# EAGLE design Adafruit Power Switch (EAGLE 6.3)
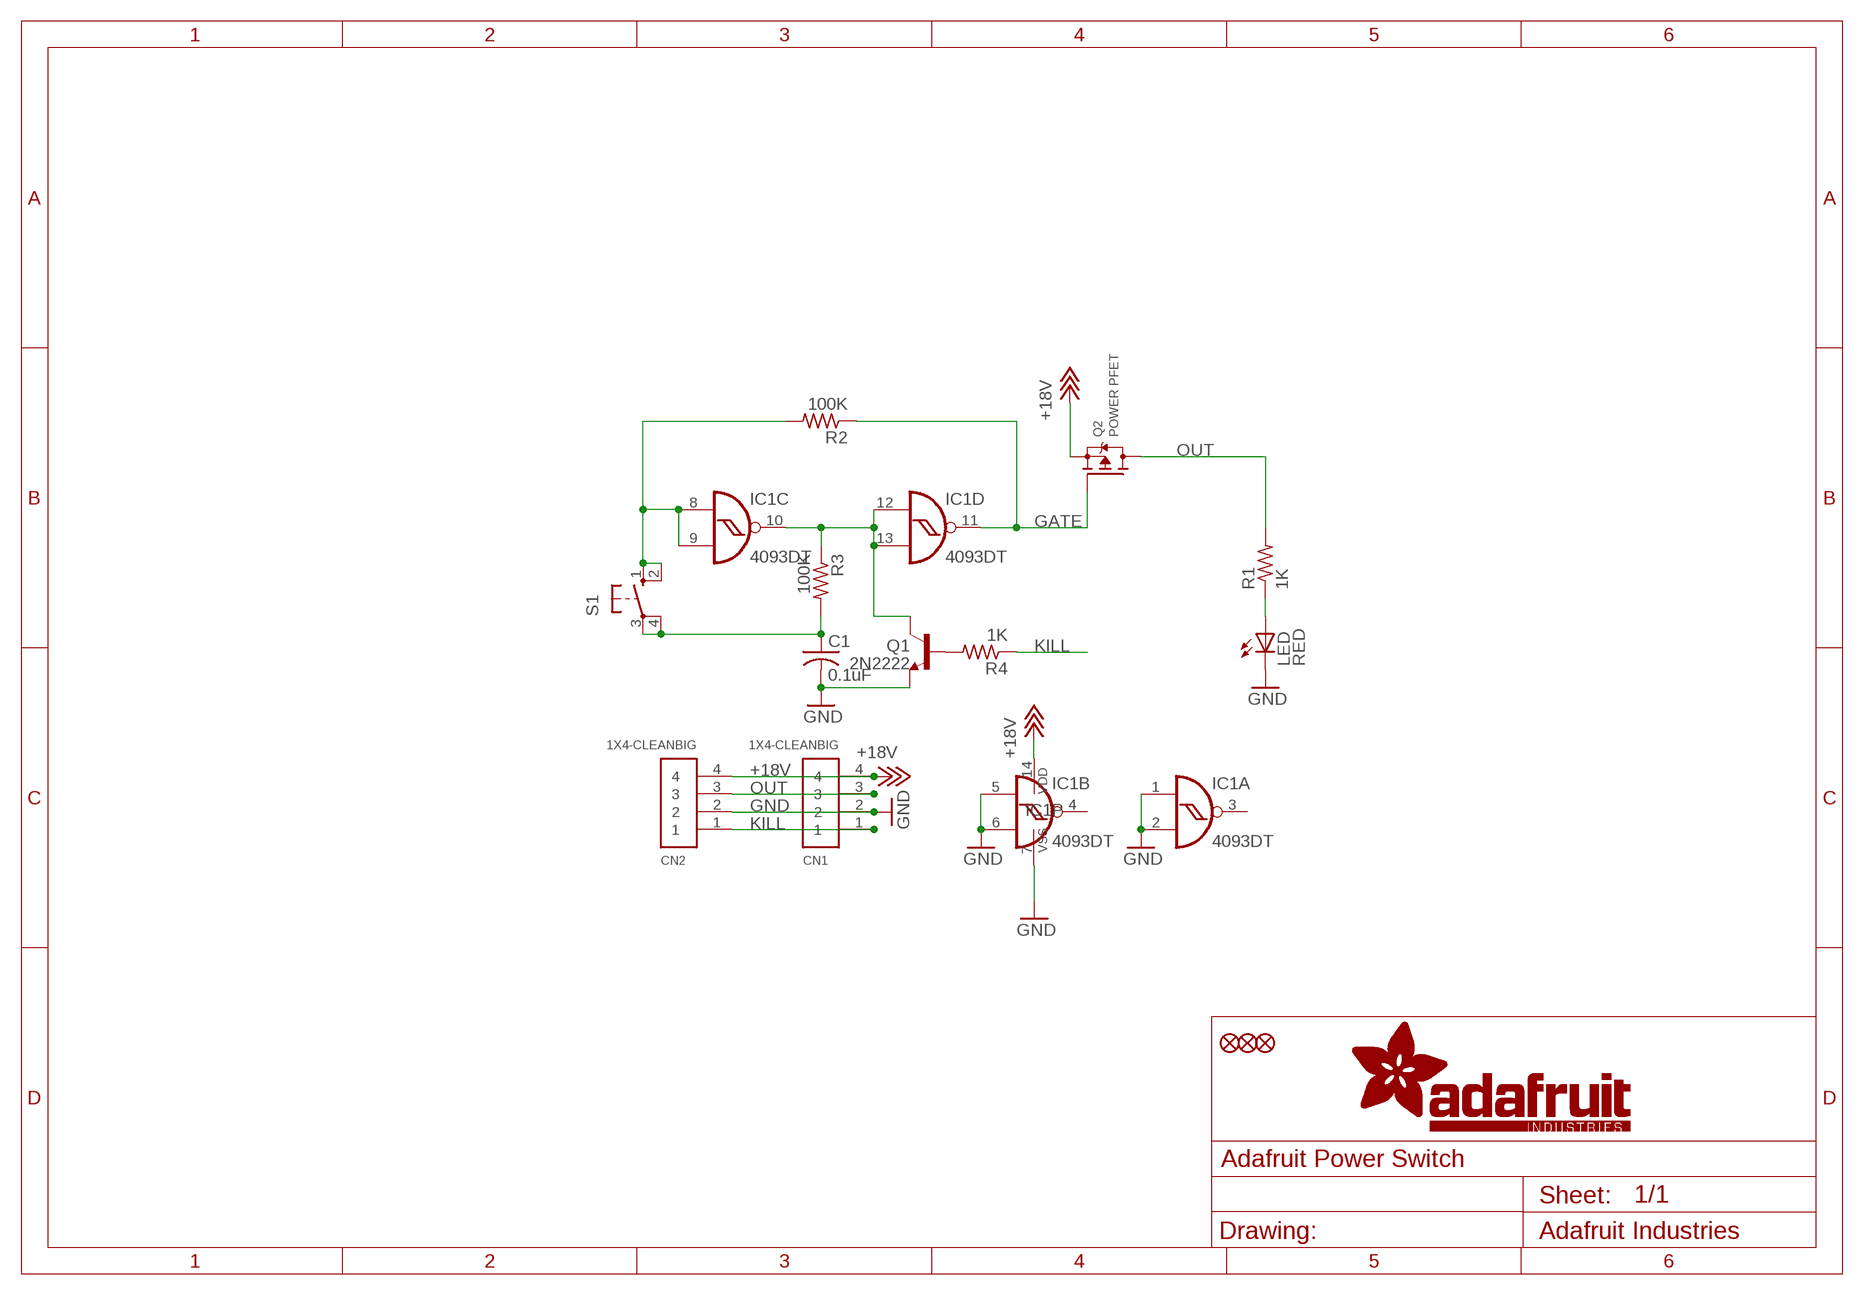
[diagram p0: schematic, sheet 1]

## Parts
C1  0.1uF  C-USC0805  [C0805]
CN1  1X4-CLEANBIG  [1X04-CLEANBIG]
CN2  1X4-CLEANBIG  [1X04-CLEANBIG]
FID1  FIDUCIAL""  [FIDUCIAL_1MM]
FID2  FIDUCIAL""  [FIDUCIAL_1MM]
FID3  FIDUCIAL""  [FIDUCIAL_1MM]
IC1  4093DT  [MC14093B-TSSOP14]
LED  RED  LEDCHIP-LED0805  [CHIP-LED0805]
Q1  2N2222  MMBT2222ALT1-NPN-SOT23-BEC  [SOT23-BEC]
Q2  POWER PFET  MOSFET-PWIDE  [SOT23-WIDE]
R1  1K  R-US_R0805  [R0805]
R2  100K  R-US_R0805  [R0805]
R3  100K  R-US_R0805  [R0805]
R4  1K  R-US_R0805  [R0805]
S1  40-XX-ROUND  [B3F-40XX-ROUND]

## Nets
+18V: CN1.4 CN2.4 IC1.14(P:VDD) Q2.2(S)
GATE: IC1.11(D:O) Q2.1(G) R2.1
GND: C1.2 CN1.2 CN2.2 IC1.1(A:I0) IC1.2(A:I1) IC1.5(B:I0) IC1.6(B:I1) IC1.7(P:VSS) LED.C Q1.E
KILL: CN1.1 CN2.1 R4.1
N$1: Q1.B R4.2
N$2: IC1.10(C:O) IC1.12(D:I0) IC1.13(D:I1) Q1.C R3.1
N$3: LED.A R1.1
N$5: C1.1 R3.2 S1.3(P) S1.4(P1)
N$7: IC1.8(C:I0) IC1.9(C:I1) R2.2 S1.1(S) S1.2(S1)
OUT: CN1.3 CN2.3 Q2.3(D) R1.2
Unconnected: IC1.3(A:O) IC1.4(B:O)

## Library data of the parts
C1 = adafruit:C-US: CAPACITOR, American symbol
CN1 CN2 = adafruit:1X4: 4-pin connector
FID1-FID3 = microbuilder:FIDUCIAL: Fiducial Alignment Points Various fiducial points for machine vision alignment.; BOM: EXCLUDE
IC1 = adafruit:4093: Quad 2-input NAND schmitt trigger
LED = adafruit:LED: LED OSRAM: - CHIPLED LG R971, LG N971, LY N971, LG Q971, LY Q971, LO R971, LY R971 LH N974, LH R974 LS Q976, LO Q976, LY Q976 LO Q996 - Hyper CHIPLED LW Q18S LB Q993, LB Q99A, LB R99A - SideLED LS A670, LO A670, LY A670, LG A670, LP A670 LB A673, LV A673, LT A673, LW A673 LH A674 LY A675 LS A676, LA A676, LO A676, LY A676, LW A676 LS A679, LY A679, LG A679 - Hyper Micro SIDELED® LS Y876, LA Y876, LO Y876, LY Y876 LT Y87S - SmartLED LW L88C, LW L88S LB L89C, LB L89S, LG L890 LS L89K, LO L89K, LY L89K LS L896, LA L896, LO L896, LY L896 - TOPLED LS T670, LO T670, LY T670, LG T670, LP T670 LSG T670, LSP T670, LSY T670, LOP T670, LYG T670 LG T671, LOG T671, LSG T671 LB T673, LV T673, LT T673, LW T673 LH T674 LS T676, LA T676, LO T676, LY T676, LB T676, LH T676, LSB T676, LW T676 LB T67C, LV T67C, LT T67C, LS T67K, LO T67K, LY T67K, LW E67C LS E67B, LA E67B, LO E67B, LY E67B, LB E67C, LV E67C, LT E67C LW T67C LS T679, LY T679, LG T679 LS T770, LO T770, LY T770, LG T770, LP T770 LB T773, LV T773, LT T773, LW T773 LH T774 LS E675, LA E675, LY E675, LS T675 LS T776, LA T776, LO T776, LY T776, LB T776 LHGB T686 LT T68C, LB T68C - Hyper Mini TOPLED® LB M676 - Mini TOPLED Santana® LG M470 LS M47K, LO M47K, LY M47K Source: http://www.osram.convergy.de/
Q1 = transistor:*-NPN-: NPN Transistror BF959 corrected 2008.03.06
Q2 = microbuilder:MOSFET-P: P-Channel Mosfet LEGEND VDS: Voltage Drain-Source ID: Drain Current RDS(ON): Drain-Source On-State Resistance VGS(TH): Gate-Source Threshold Voltage CISS: Drain-Source Input Capacitance SOT-23 Name VDS ID RDS(ON) VGS(TH) CISS Order Number IRLML5103 30V 760mA 600 mOhm -- 75pF @ 25V Digikey: IRLML5103PBFCT-ND IRLML6401 12V 4.3A 50 mOhm 950mV @ 250µA 830pF @ 10V Digikey: IRLML6401PBFTR-ND NTR0202PL 20V 400mA 800 mOhm 2.3V @ 250uA 70pF @ 5V Digikey: NTR0202PLT1GOSTR-ND NTR4101PT1G 20V 1.8A 85 mOhm 1.2V @ 250uA 675pF @ 10V Digikey: NTR4101PT1GOSCT-ND DMP2004K 20V 600mA 900 mOhm 1V @ 250uA 175pF @ 16V Digikey: DMP2004KDICT-ND PMV65XP 20V 3.9A 76 mOhm 950mV @ 1mA 725pF @ 20V Digikey: 568-2358-2-ND TO-252 Name VDS ID RDS(ON) VGS(TH) CISS Order Number AOD417 30V 25A 34 mOhm 3V @ 250µA 920pF @ 15V Digikey: 785-1106-2-ND
R1-R3 = rcl:R-US_: RESISTOR, American symbol
R4 = adafruit:R-US_: RESISTOR, American symbol
S1 = adafruit:40-XX: OMRON SWITCH

## Board
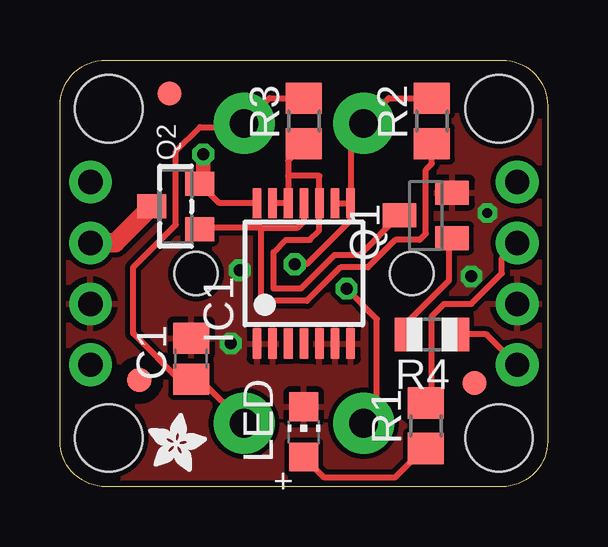
[diagram p1: board, top side]
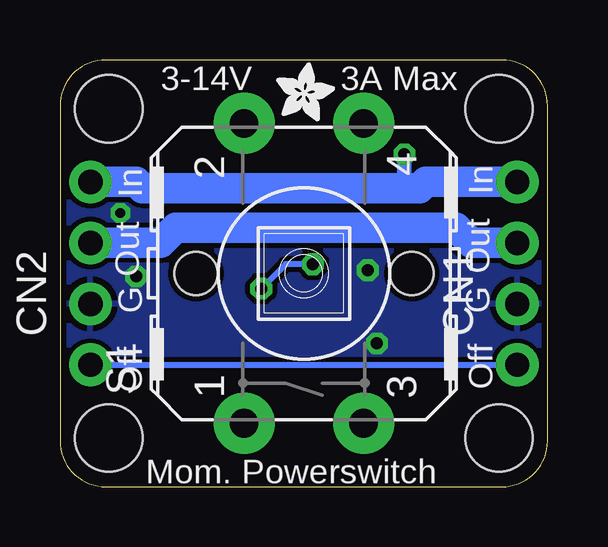
[diagram p2: board, bottom side, seen from below]

Size 20.32 x 17.78 mm. Coordinates in mm from the lower left corner, seen from the top.
Outline: 1.91,17.78 18.41,17.78 arc-90 20.32,15.88 20.32,1.91 arc-90 18.41,0 1.91,0 arc-90 0,1.91 0,15.88 arc-90 1.91,17.78
Copper layers (1*16): Top 0.035mm / dielectric 1.5mm / Bottom 0.035mm
Design rules "default": minimum track width 8mil, minimum drill 16mil, track to track 8mil, track to pad 8mil, pad to pad 8mil, via to via 8mil, smd to smd 8mil, copper to edge 10mil, drill to drill 8mil, minimum pad ring 10mil, minimum via ring 8mil, stop-mask expansion 4mil, vias tented up to drill 20mil, thermal gap 10mil
Holes 2.8 mm at 2.03,15.75 2.03,2.03 18.29,15.75 18.29,2.03

### Footprints (pad centres in the part's own frame; a part is rotated, then mirrored left to right if it is on the bottom)
C0805 = smd 1.3 x 1.5: 1 -0.85,0; 2 0.85,0
1X04-CLEANBIG = drill 1.016 pad 1.778: 1 -3.81,0; 2 -1.27,0; 3 1.27,0; 4 3.81,0
FIDUCIAL_1MM = smd 1 x 1: 1 0,0
MC14093B-TSSOP14 = smd 0.36 x 1.26: 1 -1.95,-2.925; 2 -1.3,-2.925; 3 -0.65,-2.925; 4 0,-2.925; 5 0.65,-2.925; 6 1.3,-2.925; 7 1.95,-2.925; 8 1.95,2.925; 9 1.3,2.925; 10 0.65,2.925; 11 0,2.925; 12 -0.65,2.925; 13 -1.3,2.925; 14 -1.95,2.925
CHIP-LED0805 = smd 1.2 x 1.2: A 0,-1.05; C 0,1.05
SOT23-BEC = smd 1 x 1.4: B -0.95,-1.1; C 0,1.1; E 0.95,-1.1
SOT23-WIDE = smd 1 x 1.2: 1 -0.95,-1; 2 0.95,-1; 3 0,1
R0805 = smd 1.3 x 1.5: 1 -0.95,0; 2 0.95,0
R0805' = smd 1.1 x 1.4: 1 -1,0; 2 1,0
B3F-40XX-ROUND = drill 1.194 pad 2.54: 1 -6.248,2.489; 2 6.248,2.489; 3 -6.248,-2.489; 4 6.248,-2.489 | hole 1.803: 0,-4.496; 0,4.496

### Placement (x,y rotation side)
C1  5.46,5.33 90 top
CN1  1.27,8.89 90 bottom
CN2  19.05,8.89 90 bottom
FID1  17.27,4.32 0 top
FID2  4.57,16.38 0 top
FID3  3.3,4.45 0 top
IC1  10.16,8.89 0 top
LED  10.16,2.29 0 top
Q1  15.24,11.3 90 top
Q2  4.83,11.68 90 top
R1  15.24,2.54 90 top
R2  15.49,15.24 90 top
R3  10.16,15.24 90 top
R4  1K  [R0805']  15.49,6.35 180 top
S1  10.16,8.89 90 bottom
U$1  [ADAFRUIT_2.5MM]  11.3,15.24 0 bottom
U$2  [ADAFRUIT_2.5MM]  3.68,0.64 0 top

### Tracks (layer width: path | path; a pad name or v marks a point on that pad's centre or on a via)
+18V  (via drill 0.5)
  Top 0.254: IC1.14 6.64,11.81 Q2.2 5.89,12.57 5.97,12.57
  Top 0.61: 5.97,12.57 v5.97,13.84
  Bottom 0.61: v5.97,13.84 5.97,12.45 5.84,12.45
  Bottom 1.27: CN2.4 17.14,12.7 16.89,12.45 5.84,12.45 5.33,12.45 5.08,12.7 CN1.4
GATE
  Top 0.254: IC1.11 10.16,11.05 9.91,10.79 8.38,10.79 | R2.1 15.49,13.46 15.24,13.21 15.24,10.54 14.99,10.29 13.97,10.29 12.83,9.14 11.68,9.14 10.29,7.75 8.38,7.75 8.38,10.79 | 8.38,10.79 5.89,10.79 Q2.1
GND  (via drill 0.41, 0.5)
  other vias: 17.81,11.4 7.11,5.97 7.49,9.02 17.14,8.76
  pour Bottom: 21.08,18.29 21.08,-0.76 1.27,-0.76 arc-90 0,0.51 0,17.02 arc-90 1.27,18.29
  pour Top: 21.08,18.29 21.08,-0.76 1.27,-0.76 arc-90 0,0.51 0,18.29
KILL
  Top 0.254: R4.1 17.76,6.35 arc-45 17.79,6.34 CN2.1
  Bottom 0.254: CN2.1 CN1.1
N$1
  Top 0.254: R4.2 14.49,6.87 16.21,8.59 16.21,10.35 Q1.B
N$2
  Top 0.254: IC1.13 IC1.12 9.51,12.95 | 9.51,12.95 9.51,13.59 10.16,14.24 R3.1 | 9.51,12.95 10.81,12.95 IC1.10 10.81,11.32 10.79,11.3 10.79,10.67 10.41,10.29 9.41,10.29 8.9,9.78 8.9,8.26 10.03,8.26 11.43,9.65 12.49,9.65 Q1.C
N$3
  Top 0.254: LED.A 11.02,0.38 13.95,0.38 15.16,1.59 R1.1
N$5
  Top 0.254: S1.3 5.83,4.48 C1.1 arc-45 5.37,4.45 4.99,4.45 3.05,6.39 3.05,9.14 4.83,10.92 4.83,13.97 5.84,14.99 7.52,14.99 S1.4 8.72,16.19 R3.2
N$7  (via drill 0.5)
  Top 0.254: IC1.9 IC1.8 | IC1.8 12.11,14.6 S1.2 13.7,16.19 R2.2 | S1.1 13.21,3.2 13.21,6.99 v11.94,8.26 | v9.78,9.27 10.29,9.27 12.11,11.09 IC1.8
  Bottom 0.254: v11.94,8.26 10.92,9.27 v9.78,9.27
OUT
  Top 0.254: CN2.3 18.41,9.53 18.41,8.89 17.14,7.62 16,7.62 15.49,7.11 15.49,3.79 15.24,3.54 R1.2
  Top 0.813: 2.31,10.16 2.3,10.16 | 2.3,10.16 CN1.3 | Q2.3 2.3,10.16
  Bottom 0.813: 1.78,10.16 CN1.3
  Bottom 1.27: CN2.3 16.13,10.16 15.49,10.79 3.81,10.79 3.17,10.16 CN1.3

### Text on the board
bPlace: 3A Max | 3-14V | In | In | Out | Out | G | G | Off | Off | Mom. Powerswitch